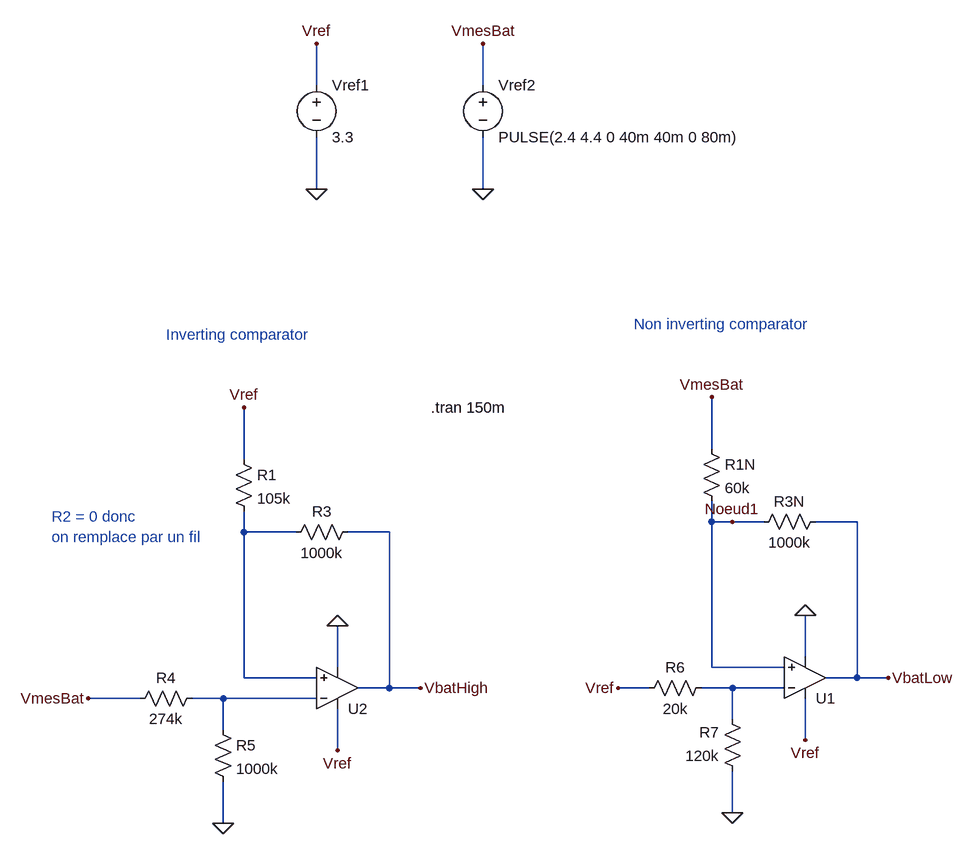
[diagram p0: schematic Ctrl_bat.asc]
Ctrl_bat.asc, the LTspice schematic file:
Version 4.1
SHEET 1 1392 680
WIRE 272 -1120 272 -1184
WIRE 528 -1120 528 -1184
WIRE 272 -960 272 -1040
WIRE 528 -960 528 -1040
WIRE 880 -560 880 -640
WIRE 160 -544 160 -624
WIRE 880 -448 880 -480
WIRE 912 -448 880 -448
WIRE 960 -448 912 -448
WIRE 1104 -448 1040 -448
WIRE 160 -432 160 -464
WIRE 240 -432 160 -432
WIRE 384 -432 320 -432
WIRE 1024 -240 1024 -304
WIRE 304 -224 304 -288
WIRE 880 -224 880 -448
WIRE 992 -224 880 -224
WIRE 160 -208 160 -432
WIRE 272 -208 160 -208
WIRE 1104 -208 1104 -448
WIRE 1104 -208 1056 -208
WIRE 1152 -208 1104 -208
WIRE 384 -192 384 -432
WIRE 384 -192 336 -192
WIRE 432 -192 384 -192
WIRE 784 -192 736 -192
WIRE 912 -192 864 -192
WIRE 992 -192 912 -192
WIRE 0 -176 -80 -176
WIRE 128 -176 80 -176
WIRE 272 -176 128 -176
WIRE 912 -144 912 -192
WIRE 128 -128 128 -176
WIRE 1024 -112 1024 -176
WIRE 304 -96 304 -160
WIRE 912 0 912 -64
WIRE 128 16 128 -48
FLAG 432 -192 VbatHigh
FLAG -80 -176 VmesBat
FLAG 160 -624 Vref
FLAG 304 -288 0
FLAG 304 -96 Vref
FLAG 128 16 0
FLAG 1152 -208 VbatLow
FLAG 736 -192 Vref
FLAG 880 -640 VmesBat
FLAG 1024 -304 0
FLAG 1024 -112 Vref
FLAG 912 -448 Noeud1
FLAG 272 -1184 Vref
FLAG 272 -960 0
FLAG 528 -1184 VmesBat
FLAG 528 -960 0
FLAG 912 0 0
SYMBOL OpAmps\\UniversalOpAmp2 304 -192 M180
SYMATTR InstName U2
SYMBOL res 144 -560 R0
SYMATTR InstName R1
SYMATTR Value 105k
SYMBOL res 336 -448 R90
WINDOW 0 0 56 VBottom 2
WINDOW 3 32 56 VTop 2
SYMATTR InstName R3
SYMATTR Value 1000k
SYMBOL res 96 -192 R90
WINDOW 0 0 56 VBottom 2
WINDOW 3 32 56 VTop 2
SYMATTR InstName R4
SYMATTR Value 274k
SYMBOL res 112 -144 R0
SYMATTR InstName R5
SYMATTR Value 1000k
SYMBOL OpAmps\\UniversalOpAmp2 1024 -208 M180
SYMATTR InstName U1
SYMBOL res 864 -576 R0
SYMATTR InstName R1N
SYMATTR Value 60k
SYMBOL res 1056 -464 R90
WINDOW 0 0 56 VBottom 2
WINDOW 3 32 56 VTop 2
SYMATTR InstName R3N
SYMATTR Value 1000k
SYMBOL voltage 272 -1136 R0
WINDOW 123 0 0 Left 0
WINDOW 39 0 0 Left 0
SYMATTR InstName Vref1
SYMATTR Value 3.3
SYMBOL voltage 528 -1136 R0
WINDOW 123 0 0 Left 0
WINDOW 39 0 0 Left 0
SYMATTR InstName Vref2
SYMATTR Value PULSE(2.4 4.4 0 40m 40m 0 80m)
SYMBOL res 880 -208 R90
WINDOW 0 0 56 VBottom 2
WINDOW 3 32 56 VTop 2
SYMATTR InstName R6
SYMATTR Value 20k
SYMBOL res 928 -48 R180
WINDOW 0 36 76 Left 2
WINDOW 3 36 40 Left 2
SYMATTR InstName R7
SYMATTR Value 120k
TEXT 40 -736 Left 2 ;Inverting comparator
TEXT 760 -752 Left 2 ;Non inverting comparator
TEXT 448 -624 Left 2 !.tran 150m
TEXT -136 -456 Left 2 ;R2 = 0 donc \non remplace par un fil

The netlist it stands for:
* Ctrl_bat.asc
X§U2 N001 N003 Vref 0 VbatHigh level2 Avol=1Meg GBW=10Meg Slew=10Meg Ilimit=25m Rail=0 Vos=0 En=0 Enk=0 In=0 Ink=0 Rin=500Meg  ; pins In+ In- V+ V- OUT
R1 Vref N001 105k
R3 VbatHigh N001 1000k
R4 N003 VmesBat 274k
R5 N003 0 1000k
X§U1 Noeud1 N002 Vref 0 VbatLow level2 Avol=1Meg GBW=10Meg Slew=10Meg Ilimit=25m Rail=0 Vos=0 En=0 Enk=0 In=0 Ink=0 Rin=500Meg  ; pins In+ In- V+ V- OUT
R1N VmesBat Noeud1 60k
R3N VbatLow Noeud1 1000k
Vref1 Vref 0 3.3
Vref2 VmesBat 0 PULSE(2.4 4.4 0 40m 40m 0 80m)
R6 N002 Vref 20k
R7 0 N002 120k
* Inverting comparator
* Non inverting comparator
.tran 150m
* R2 = 0 donc
* on remplace par un fil
.lib UniversalOpAmp2.lib
.backanno
.end